# EAGLE design Placa Madre Taylor (EAGLE 9.6.2)
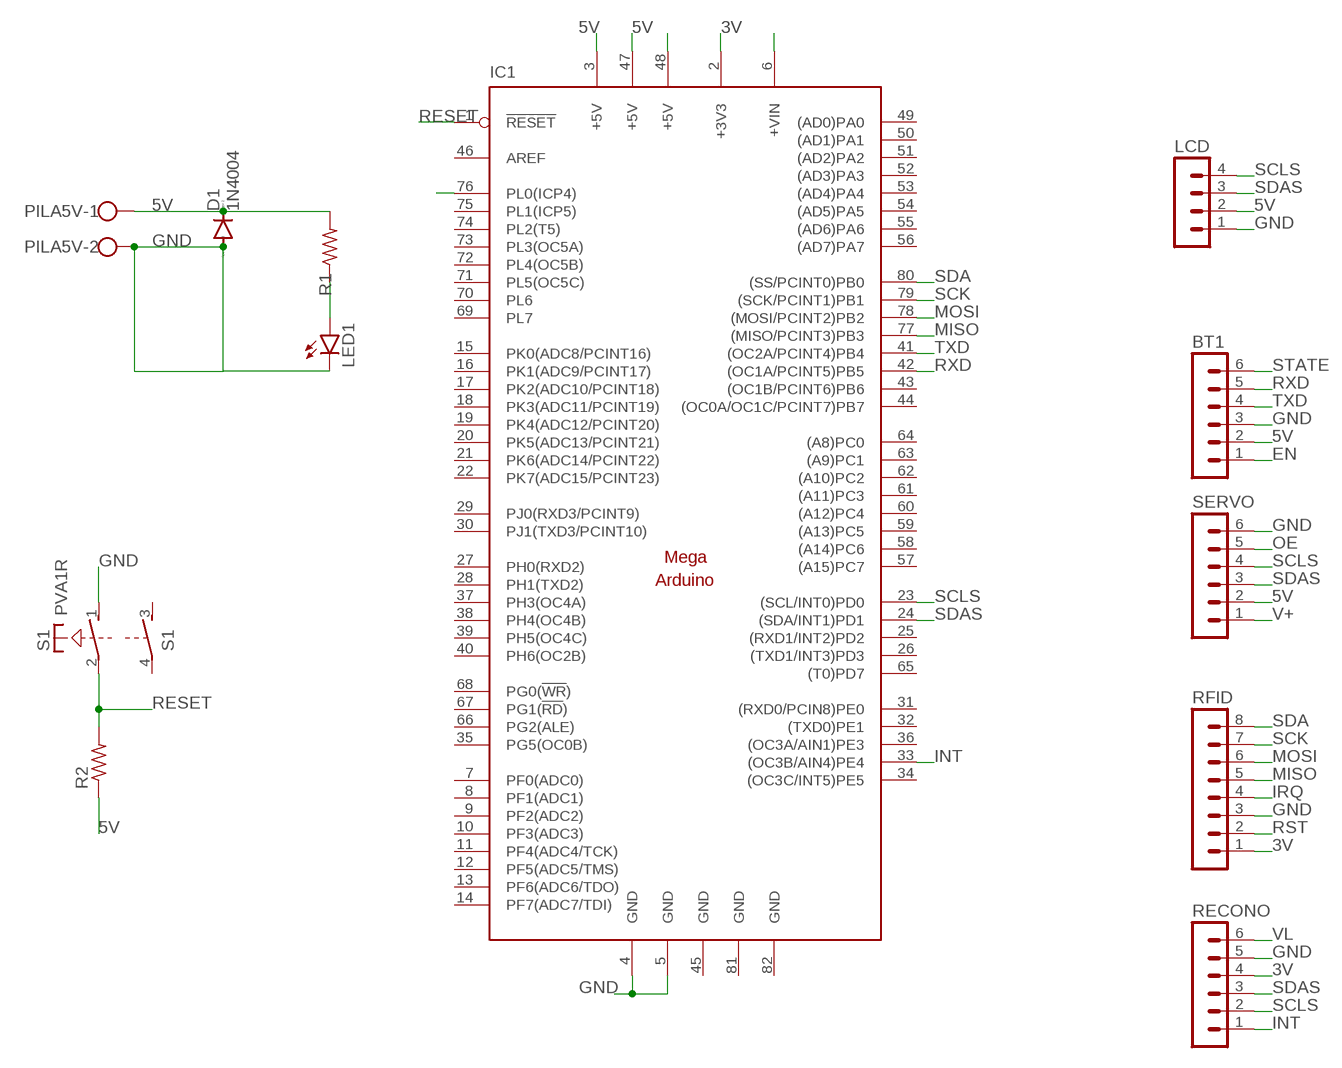
[diagram p0: schematic, sheet 1]

## Parts
BT1  MA06-1  [MA06-1]
D1  1N4004  [DO41-10]
IC1  MEGAARDUINO_11  [MEGA_ARDUINO_1]
LCD  MA04-1  [MA04-1]
LED1  LED3MM  [LED3MM]
PILA5V  W237-102  [W237-102]
R1  R-US_0204/7  [0204/7]
R2  R-US_0207/10  [0207/10]
RECONO  MA06-1  [MA06-1]
RFID  MA08-1  [MA08-1]
S1  PVA1R  [PVA1R]
SERVO  MA06-1  [MA06-1]

## Nets
3V: IC1.2(+3V3) RECONO.4 RFID.1
5V: BT1.2 D1.C IC1.3(+5V) IC1.6(+VIN) IC1.47(+5V) LCD.2 PILA5V.1 R1.2 R2.1 SERVO.2
EN: BT1.1
GND: BT1.3 D1.A IC1.4(GND) IC1.5(GND) LCD.1 LED1.K(C) PILA5V.2 RECONO.5 RFID.3 S1.1(1:S) SERVO.6
INT: IC1.33((OC3B/AIN4)PE4) RECONO.1
IRQ: RFID.4
MISO: IC1.77((MISO/PCINT3)PB3) RFID.5
MOSI: IC1.78((MOSI/PCINT2)PB2) RFID.6
N$26: LED1.A R1.1
N$30: IC1.48(+5V)
OE: SERVO.5
RESET: IC1.1(!RESET) R2.2 S1.2(1:P)
RST: IC1.76(PL0(ICP4)) RFID.2
RXD: BT1.5 IC1.42((OC1A/PCINT5)PB5)
SCK: IC1.79((SCK/PCINT1)PB1) RFID.7
SCLS: IC1.23((SCL/INT0)PD0) LCD.4 RECONO.2 SERVO.4
SDA: IC1.80((SS/PCINT0)PB0) RFID.8
SDAS: IC1.24((SDA/INT1)PD1) LCD.3 RECONO.3 SERVO.3
STATE: BT1.6
TXD: BT1.4 IC1.41((OC2A/PCINT4)PB4)
V+: SERVO.1
VL: RECONO.6
Unconnected: IC1.7(PF0(ADC0)) IC1.8(PF1(ADC1)) IC1.9(PF2(ADC2)) IC1.10(PF3(ADC3)) IC1.11(PF4(ADC4/TCK)) IC1.12(PF5(ADC5/TMS)) IC1.13(PF6(ADC6/TDO)) IC1.14(PF7(ADC7/TDI)) IC1.15(PK0(ADC8/PCINT16)) IC1.16(PK1(ADC9/PCINT17)) IC1.17(PK2(ADC10/PCINT18)) IC1.18(PK3(ADC11/PCINT19)) IC1.19(PK4(ADC12/PCINT20)) IC1.20(PK5(ADC13/PCINT21)) IC1.21(PK6(ADC14/PCINT22)) IC1.22(PK7(ADC15/PCINT23)) IC1.25((RXD1/INT2)PD2) IC1.26((TXD1/INT3)PD3) IC1.27(PH0(RXD2)) IC1.28(PH1(TXD2)) IC1.29(PJ0(RXD3/PCINT9)) IC1.30(PJ1(TXD3/PCINT10)) IC1.31((RXD0/PCIN8)PE0) IC1.32((TXD0)PE1) IC1.34((OC3C/INT5)PE5) IC1.35(PG5(OC0B)) IC1.36((OC3A/AIN1)PE3) IC1.37(PH3(OC4A)) IC1.38(PH4(OC4B)) IC1.39(PH5(OC4C)) IC1.40(PH6(OC2B)) IC1.43((OC1B/PCINT6)PB6) IC1.44((OC0A/OC1C/PCINT7)PB7) IC1.46(AREF) IC1.49((AD0)PA0) IC1.50((AD1)PA1) IC1.51((AD2)PA2) IC1.52((AD3)PA3) IC1.53((AD4)PA4) IC1.54((AD5)PA5) IC1.55((AD6)PA6) IC1.56((AD7)PA7) IC1.57((A15)PC7) IC1.58((A14)PC6) IC1.59((A13)PC5) IC1.60((A12)PC4) IC1.61((A11)PC3) IC1.62((A10)PC2) IC1.63((A9)PC1) IC1.64((A8)PC0) IC1.65((T0)PD7) IC1.66(PG2(ALE)) IC1.67(PG1(!RD!)) IC1.68(PG0(!WR!)) IC1.69(PL7) IC1.70(PL6) IC1.71(PL5(OC5C)) IC1.72(PL4(OC5B)) IC1.73(PL3(OC5A)) IC1.74(PL2(T5)) IC1.75(PL1(ICP5)) S1.3(2:S) S1.4(2:P)

## Power pins joined to a net without a drawn wire
GND: IC1.45(GND) IC1.81(GND) IC1.82(GND)

## Library data of the parts
BT1 RECONO SERVO = con-lstb:MA06-1: PIN HEADER; OC_FARNELL: unknown; OC_NEWARK: unknown
D1 = diode:1N4004: DIODE general purpose rectifier, 1 A
IC1 = arduino:MEGAARDUINO_1: The Arduino Mega is a microcontroller board based on the ATmega1280. - 54 digital input/output pins (of which 14 can be used as PWM outputs) - 16 analog inputs - 4 UARTs (hardware serial ports) - 16 MHz crystal oscillator - USB connection - power jack - ICSP header - reset button It contains everything needed to support the microcontroller; simply connect it to a computer with a USB cable or power it with a AC-to-DC adapter or battery to get started. The Mega is compatible with most shields designed for the Arduino Duemilanove or Diecimila. http://arduino.cc/en/Main/ArduinoBoardMega
LCD = con-lstb:MA04-1: PIN HEADER; OC_FARNELL: unknown; OC_NEWARK: unknown
LED1 = led:LED: LED OSRAM: - CHIPLED LG R971, LG N971, LY N971, LG Q971, LY Q971, LO R971, LY R971 LH N974, LH R974 LS Q976, LO Q976, LY Q976 LO Q996 - Hyper CHIPLED LW Q18S LB Q993, LB Q99A, LB R99A - SideLED LS A670, LO A670, LY A670, LG A670, LP A670 LB A673, LV A673, LT A673, LW A673 LH A674 LY A675 LS A676, LA A676, LO A676, LY A676, LW A676 LS A679, LY A679, LG A679 - Hyper Micro SIDELED® LS Y876, LA Y876, LO Y876, LY Y876 LT Y87S - SmartLED LW L88C, LW L88S LB L89C, LB L89S, LG L890 LS L89K, LO L89K, LY L89K LS L896, LA L896, LO L896, LY L896 - TOPLED LS T670, LO T670, LY T670, LG T670, LP T670 LSG T670, LSP T670, LSY T670, LOP T670, LYG T670 LG T671, LOG T671, LSG T671 LB T673, LV T673, LT T673, LW T673 LH T674 LS T676, LA T676, LO T676, LY T676, LB T676, LH T676, LSB T676, LW T676 LB T67C, LV T67C, LT T67C, LS T67K, LO T67K, LY T67K, LW E67C LS E67B, LA E67B, LO E67B, LY E67B, LB E67C, LV E67C, LT E67C LW T67C LS T679, LY T679, LG T679 LS T770, LO T770, LY T770, LG T770, LP T770 LB T773, LV T773, LT T773, LW T773 LH T774 LS E675, LA E675, LY E675, LS T675 LS T776, LA T776, LO T776, LY T776, LB T776 LHGB T686 LT T68C, LB T68C - Hyper Mini TOPLED® LB M676 - Mini TOPLED Santana® LG M470 LS M47K, LO M47K, LY M47K Source: http://www.osram.convergy.de LUXEON: - LUMILED® LXK2-PW12-R00, LXK2-PW12-S00, LXK2-PW14-U00, LXK2-PW14-V00 LXK2-PM12-R00, LXK2-PM12-S00, LXK2-PM14-U00 LXK2-PE12-Q00, LXK2-PE12-R00, LXK2-PE12-S00, LXK2-PE14-T00, LXK2-PE14-U00 LXK2-PB12-K00, LXK2-PB12-L00, LXK2-PB12-M00, LXK2-PB14-N00, LXK2-PB14-P00, LXK2-PB14-Q00 LXK2-PR12-L00, LXK2-PR12-M00, LXK2-PR14-Q00, LXK2-PR14-R00 LXK2-PD12-Q00, LXK2-PD12-R00, LXK2-PD12-S00 LXK2-PH12-R00, LXK2-PH12-S00 LXK2-PL12-P00, LXK2-PL12-Q00, LXK2-PL12-R00 Source: www.luxeon.com KINGBRIGHT: KA-3528ASYC Source: www.kingbright.com
PILA5V = con-wago-500:W237-102: WAGO SCREW CLAMP; MPN: 237-102; OC_FARNELL: unknown; OC_NEWARK: 70K9898
R1 R2 = rcl:R-US_: RESISTOR, American symbol; SPICEPREFIX: R
RFID = con-lstb:MA08-1: PIN HEADER; OC_FARNELL: unknown; OC_NEWARK: unknown
S1 = switch-misc:PVA1R: ITT SWITCH

## Board
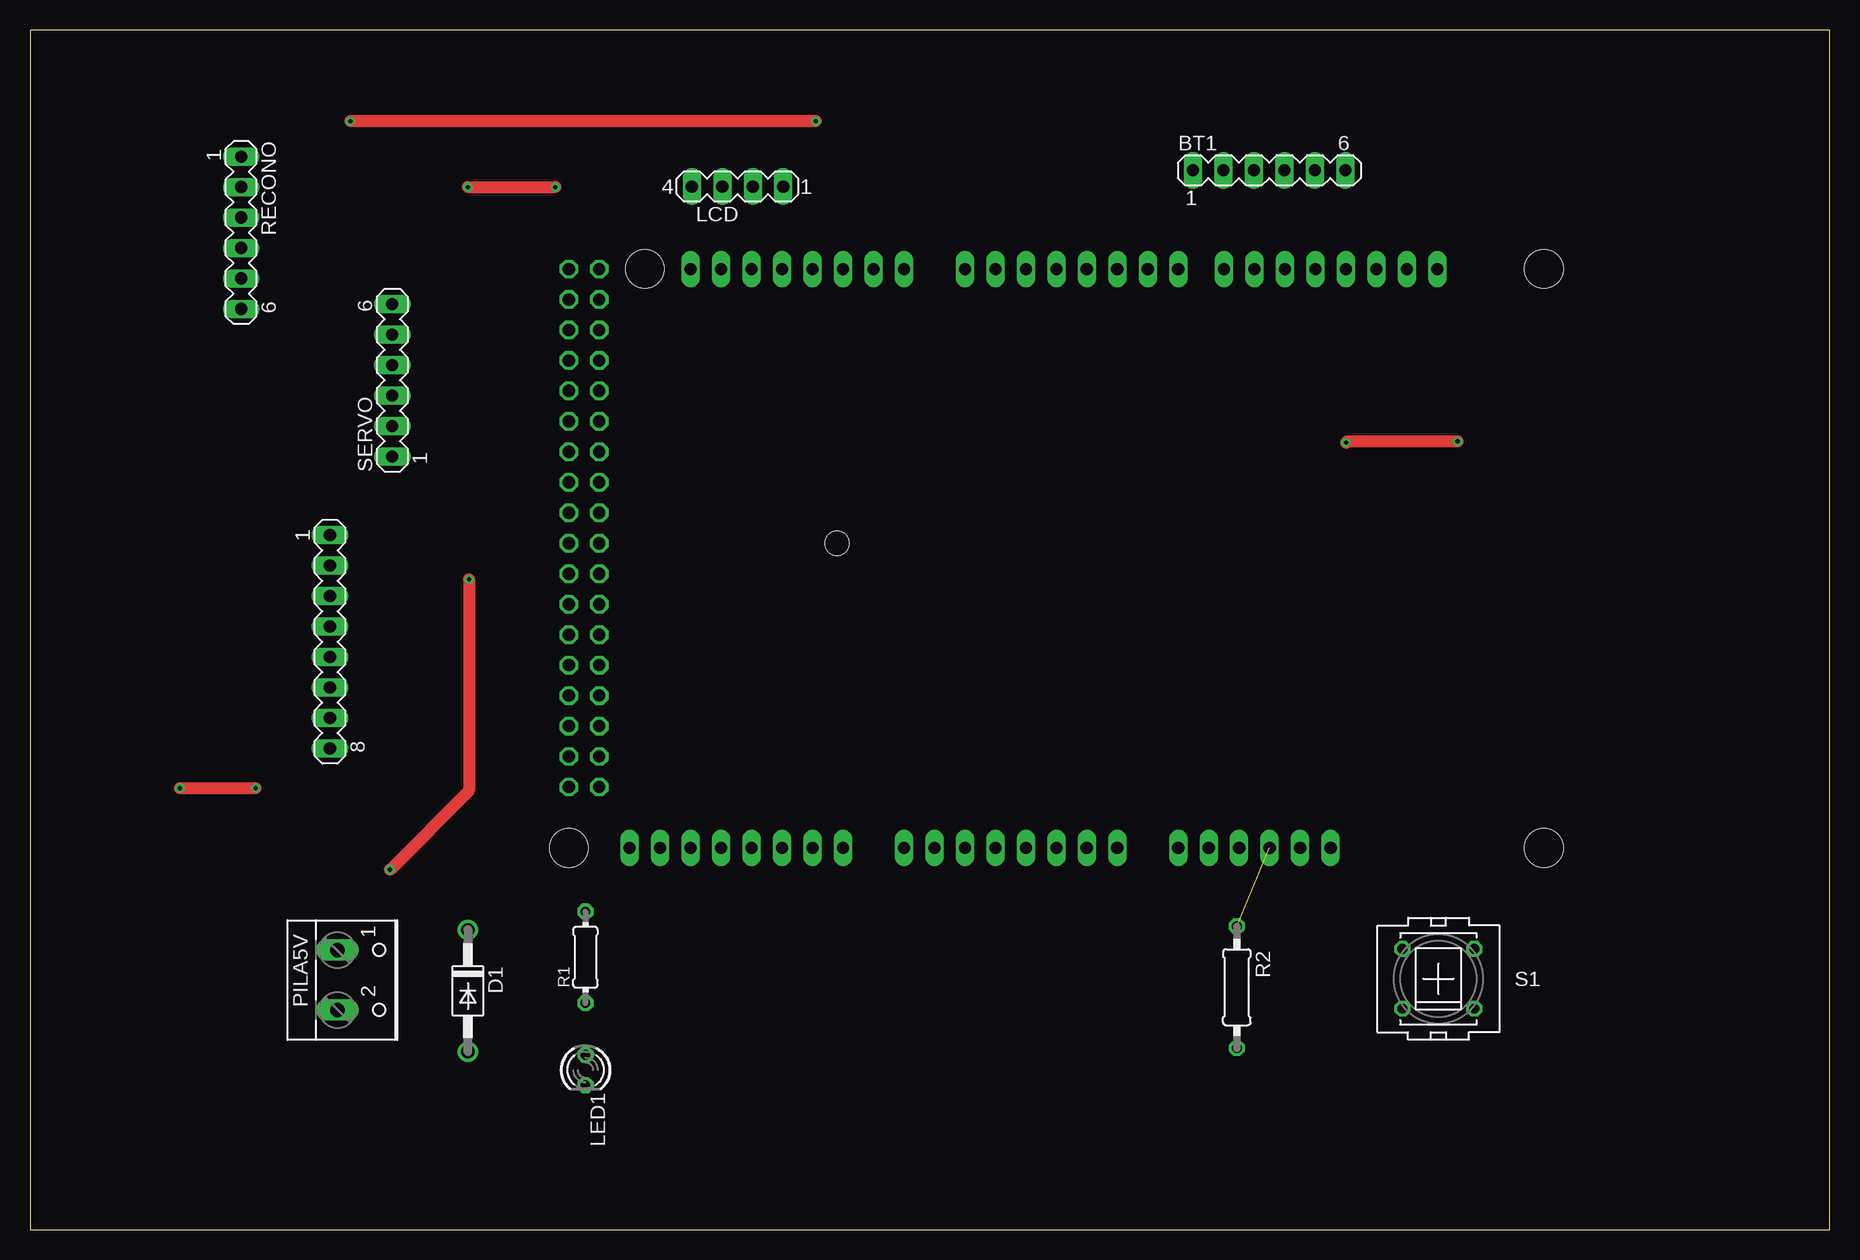
[diagram p1: board, top side]
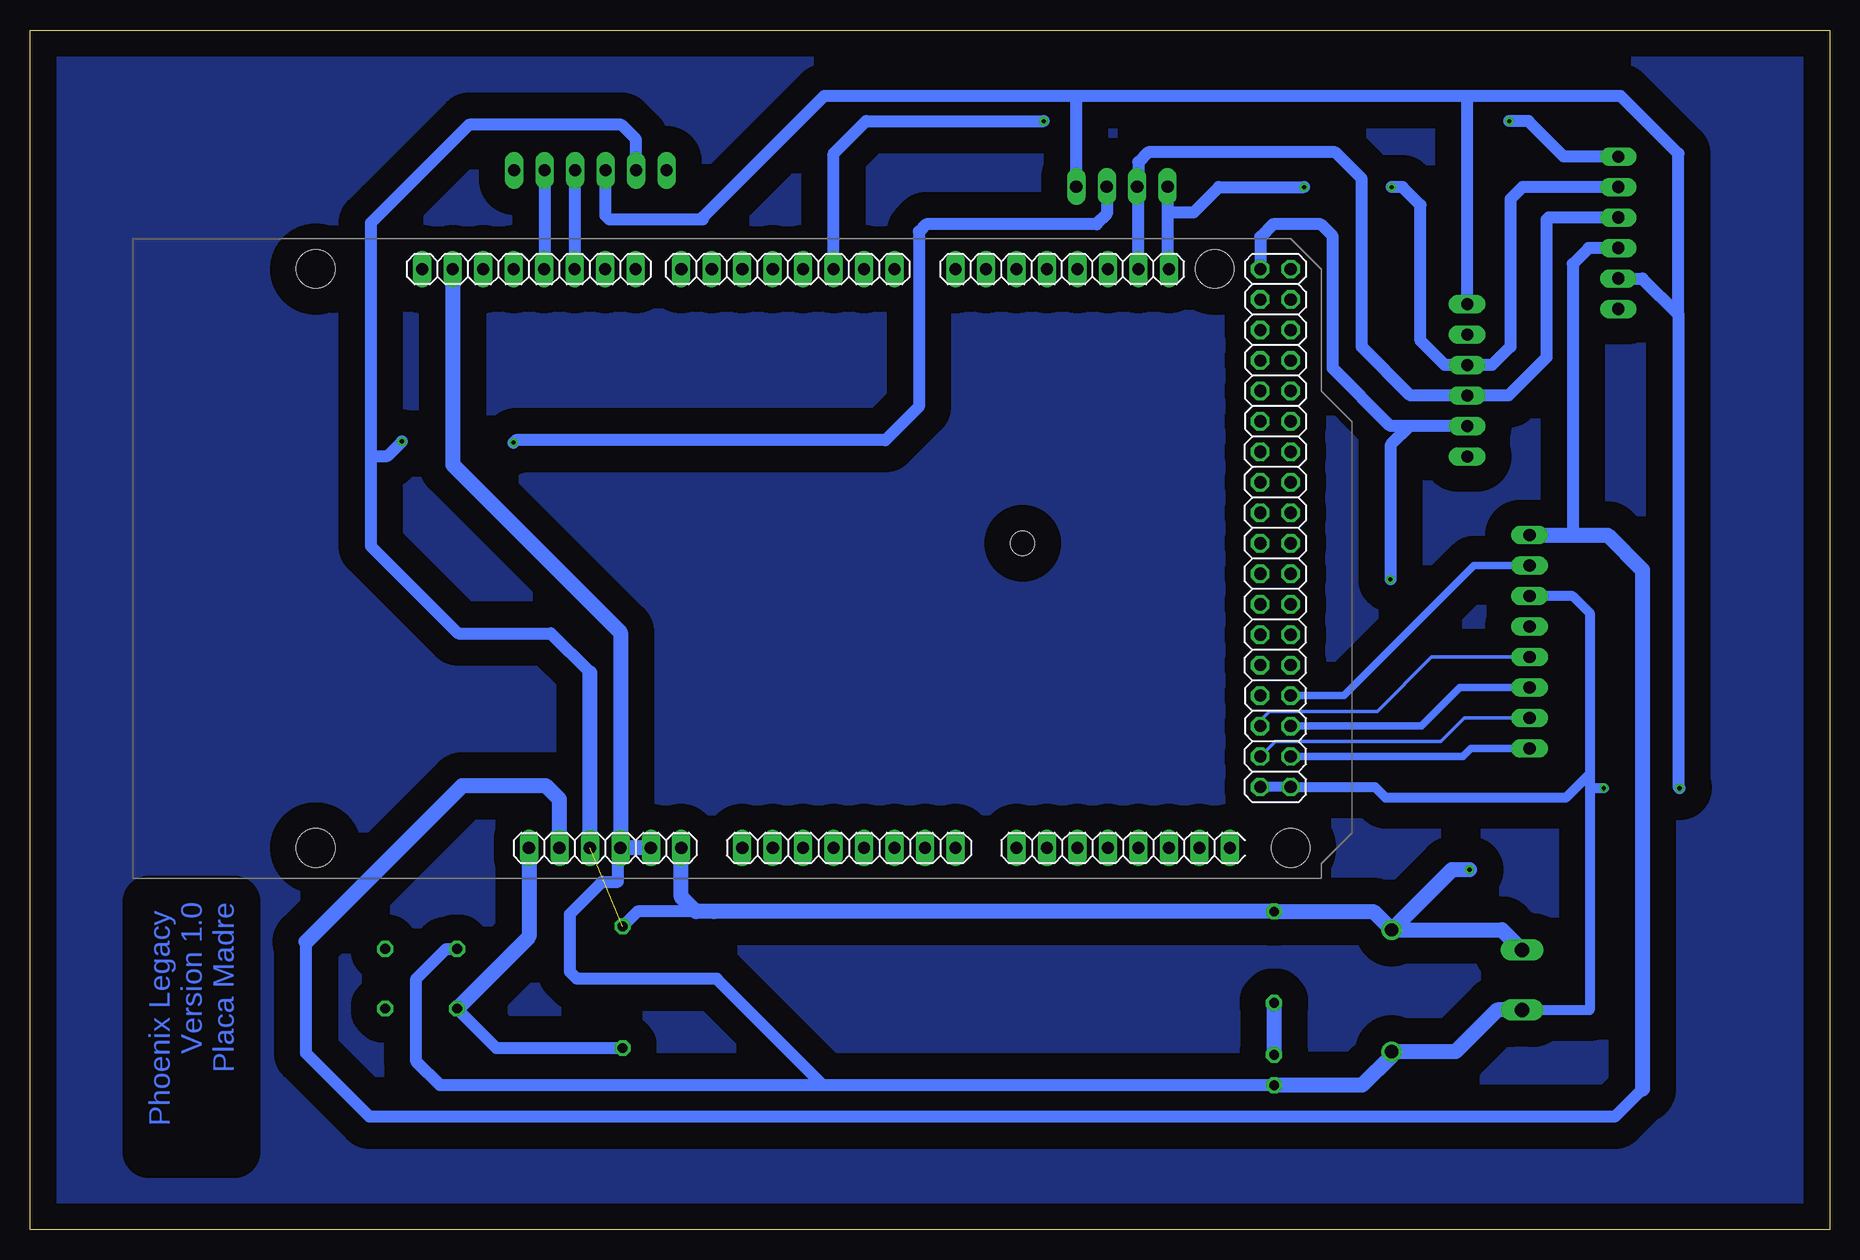
[diagram p2: board, bottom side, seen from below]

Size 150 x 100 mm. Coordinates in mm from the lower left corner, seen from the top.
Outline: 0,0 150,0 150,100 0,100 0,0
Copper layers (1*16): Top 0.035mm / dielectric 1.5mm / Bottom 0.035mm
Design rules "default": minimum track width 6mil, minimum drill 0.35mm, track to track 6mil, track to pad 6mil, pad to pad 6mil, via to via 6mil, smd to smd 6mil, copper to edge 40mil, drill to drill 6mil, minimum pad ring 10mil, minimum via ring 8mil, stop-mask expansion 4mil, vias tented up to drill 0mil, thermal gap 10mil

### Footprints (pad centres in the part's own frame; a part is rotated, then mirrored left to right if it is on the bottom)
MA06-1 = drill 1.016 long: 1 -6.35,0; 2 -3.81,0; 3 -1.27,0; 4 1.27,0; 5 3.81,0; 6 6.35,0
DO41-10 = drill 1.118: A 5.08,0; C -5.08,0
MEGA_ARDUINO_1 = drill 1.016 long: 1 33.02,2.54; 2 35.56,2.54; 3 38.1,2.54; 4 40.64,2.54; 5 43.18,2.54; 6 45.72,2.54; 7 50.8,2.54; 8 53.34,2.54; 9 55.88,2.54; 10 58.42,2.54; 11 60.96,2.54; 12 63.5,2.54; 13 66.04,2.54; 14 68.58,2.54; 15 73.66,2.54; 16 76.2,2.54; 17 78.74,2.54; 18 81.28,2.54; 19 83.82,2.54; 20 86.36,2.54; 21 88.9,2.54; 22 91.44,2.54; 23 86.36,50.8; 24 83.82,50.8; 25 81.28,50.8; 26 78.74,50.8; 27 76.2,50.8; 28 73.66,50.8; 29 71.12,50.8; 30 68.58,50.8; 31 63.5,50.8; 32 60.96,50.8; 33 58.42,50.8; 34 55.88,50.8; 35 53.34,50.8; 36 50.8,50.8; 37 48.26,50.8; 38 45.72,50.8; 39 41.91,50.8; 40 39.37,50.8; 41 36.83,50.8; 42 34.29,50.8; 43 31.75,50.8; 44 29.21,50.8; 45 26.67,50.8; 46 24.13,50.8 | drill 1.016 octagon: 47 93.98,50.8; 48 96.52,50.8; 49 93.98,48.26; 50 96.52,48.26; 51 93.98,45.72; 52 96.52,45.72; 53 93.98,43.18; 54 96.52,43.18; 55 93.98,40.64; 56 96.52,40.64; 57 93.98,38.1; 58 96.52,38.1; 59 93.98,35.56; 60 96.52,35.56; 61 93.98,33.02; 62 96.52,33.02; 63 93.98,30.48; 64 96.52,30.48; 65 93.98,27.94; 66 96.52,27.94; 67 93.98,25.4; 68 96.52,25.4; 69 93.98,22.86; 70 96.52,22.86; 71 93.98,20.32; 72 96.52,20.32; 73 93.98,17.78; 74 96.52,17.78; 75 93.98,15.24; 76 96.52,15.24; 77 93.98,12.7; 78 96.52,12.7; 79 93.98,10.16; 80 96.52,10.16; 81 93.98,7.62; 82 96.52,7.62 | hole 3.2: 15.24,50.8; 15.24,2.54; 90.17,50.8; 96.52,2.54 | hole 2: 74.168,27.94
MA04-1 = drill 1.016 long: 1 -3.81,0; 2 -1.27,0; 3 1.27,0; 4 3.81,0
LED3MM = drill 0.813 octagon: A -1.27,0; K 1.27,0
W237-102 = drill 1.194 long: 1 -2.5,-1.27; 2 2.5,-1.27
0204/7 = drill 0.813 octagon: 1 -3.81,0; 2 3.81,0
0207/10 = drill 0.813 octagon: 1 -5.08,0; 2 5.08,0
MA08-1 = drill 1.016 long: 1 -8.89,0; 2 -6.35,0; 3 -3.81,0; 4 -1.27,0; 5 1.27,0; 6 3.81,0; 7 6.35,0; 8 8.89,0
PVA1R = drill 0.813 octagon: 1 -2.997,2.489; 2 -2.997,-2.489; 3 2.997,2.489; 4 2.997,-2.489

### Placement (x,y rotation side)
BT1  103.3,88.3 0 top
D1  36.5,19.9 270 top
IC1  141.43,29.27 0 bottom
LCD  58.98,86.95 180 top
LED1  46.3,13.3 270 top
PILA5V  26.9,20.8 270 top
R1  46.3,22.7 90 top
R2  100.6,20.2 270 top
RECONO  17.6,83.1 270 top
RFID  25,49 270 top
S1  117.4,20.9 0 top
SERVO  30.2,70.8 90 top

### Tracks (layer width: path | path; a pad name or v marks a point on that pad's centre or on a via)
3V
  Bottom 1.016: RECONO.4 20.07,81.83 21.4,80.5 21.4,57.89 | 15.6,11.7 17.9,9.4 121.7,9.4 127,14.7 127,24
  Bottom 1.27: IC1.2 105.87,35.87 107,37 114,37 127,24 | 15.6,11.7 15.6,55 18.49,57.89 21.4,57.89 RFID.1
5V  (via drill 0.35)  (1 unrouted)
  Top 1.016: v119,65.7 109.8,65.7 v109.7,65.6 | v36.6,54.2 36.6,36.6 v30,30
  Bottom 1.016: SERVO.2 35,66.99 | 35,66.99 36.59,66.99 41.4,71.8 41.4,82.8 42.4,83.8 46.4,83.8 47.45,82.75 IC1.47 | LCD.2 60.25,84.65 61.1,83.8 75.3,83.8 75.9,83.2 75.9,68.6 78.7,65.8 109.5,65.8 v109.7,65.6 | 103.33,46.43 106.6,49.7 114.3,49.7 121.6,57 121.6,64.5 | BT1.2 99.49,90.89 100.7,92.1 113.4,92.1 121.6,83.9 121.6,64.5 | 121.6,64.5 120.2,64.5 v119,65.7 | 35,66.99 36.6,65.39 v36.6,54.2 | 93,26.51 99.37,26.51 R2.1
  Bottom 1.27: PILA5V.1 27.31,24.98 D1.C | D1.C 38.03,26.51 R1.2 93,26.51 94.51,26.51 95.71,27.71 IC1.6 | v30,30 31.48,30 D1.C | IC1.3 103.33,46.43
GND  (via drill 0.35)
  Top 1.016: v12.5,36.8 v18.8,36.8
  Bottom 0.813: 20,38 22,36 37,36 37.89,36.89 IC1.82 IC1.81 | PILA5V.2 20,18.3 20,37.1 | RFID.3 21.41,52.81 20,51.4 20,38 | 20,38 20,37.1 | 20,37.1 19.7,36.8 v18.8,36.8
  Bottom 1.016: RECONO.5 15.59,79.29 12.6,76.3 | v12.5,36.8 12.6,36.9 12.6,76.3 | 30.05,77 SERVO.6 30.2,94.3 30,94.5 | 12.6,76.3 12.6,89.7 17.4,94.5 30,94.5 | 30,94.5 62.8,94.5 | 62.8,94.5 LCD.1 | BT1.3 102.03,84.53 101.7,84.2 93.9,84.2 93.9,84.4 83.8,94.5 62.8,94.5 | LED1.K 83.9,12.03 | 83.9,12.03 115.83,12.03 117.8,14 117.8,20.9 115.31,23.39 S1.1 | IC1.4 101,31.6 101,29 102.3,29 105,26.3 105,21.5 104.4,20.9 92.77,20.9 83.9,12.03
  Bottom 1.27: PILA5V.2 27.7,18.3 31.18,14.82 D1.A 36.5,14.5 38.97,12.03 LED1.K | IC1.5 IC1.4 100.79,49.79 114.76,63.76 IC1.45
INT  (via drill 0.35)
  Top 1.016: v65.5,92.4 v26.7,92.4
  Bottom 1.016: 17.65,89.5 RECONO.1 22.15,89.45 25.1,92.4 v26.7,92.4 | IC1.33 83.01,89.69 80.3,92.4 v65.5,92.4
MISO
  Bottom 0.305: RFID.5 33.17,47.73 37.7,43.2 46.7,43.2 47.45,42.45 IC1.77
MOSI
  Bottom 0.61: IC1.78 34.03,41.97 30.81,45.19 RFID.6
N$26
  Bottom 1.27: R1.1 LED1.A
PLACA
  pour Bottom (isolate 2.184): 0,100 0,0 150,0 150,100
RESET
  Bottom 1.016: R2.2 111.11,15.12 S1.2
  Bottom 1.27: IC1.1 108.41,24.4 S1.2
RST
  Bottom 0.61: IC1.76 40.49,44.51 29.65,55.35 RFID.2
RXD
  Bottom 1.016: BT1.5 107.11,80.1 IC1.42
SCK
  Bottom 0.305: IC1.79 46.18,40.7 32.4,40.7 30.45,42.65 RFID.7
SCLS  (via drill 0.35)
  Top 1.016: v36.5,86.9 v43.8,86.9
  Bottom 1.016: RECONO.2 25.59,86.91 26.6,85.9 26.6,73.6 28.13,72.07 SERVO.4 32.07,72.07 34.1,74.1 34.1,85.4 35.6,86.9 v36.5,86.9 | LCD.4 55.17,84.8 | 55.17,84.8 55.17,80.17 IC1.23 | 55.17,84.8 53,84.8 50.9,86.9 v43.8,86.9
SDA
  Bottom 0.61: IC1.80 30.57,39.43 29.89,40.11 RFID.8
SDAS
  Bottom 1.016: RECONO.3 23.43,84.37 23.6,84.2 23.6,72.7 26.77,69.53 SERVO.3 34.93,69.53 39,73.6 39,87.6 41.2,89.8 56.8,89.8 57.61,88.99 57.61,86.85 | IC1.24 57.61,86.85 | 57.61,86.85 LCD.3
TXD
  Bottom 1.016: BT1.4 104.6,88.27 IC1.41

### Text on the board
Bottom: Phoenix Legacy / Version 1.0 / Placa Madre